# EAGLE design Power Supply Flat Rev C (EAGLE 9.6.2)
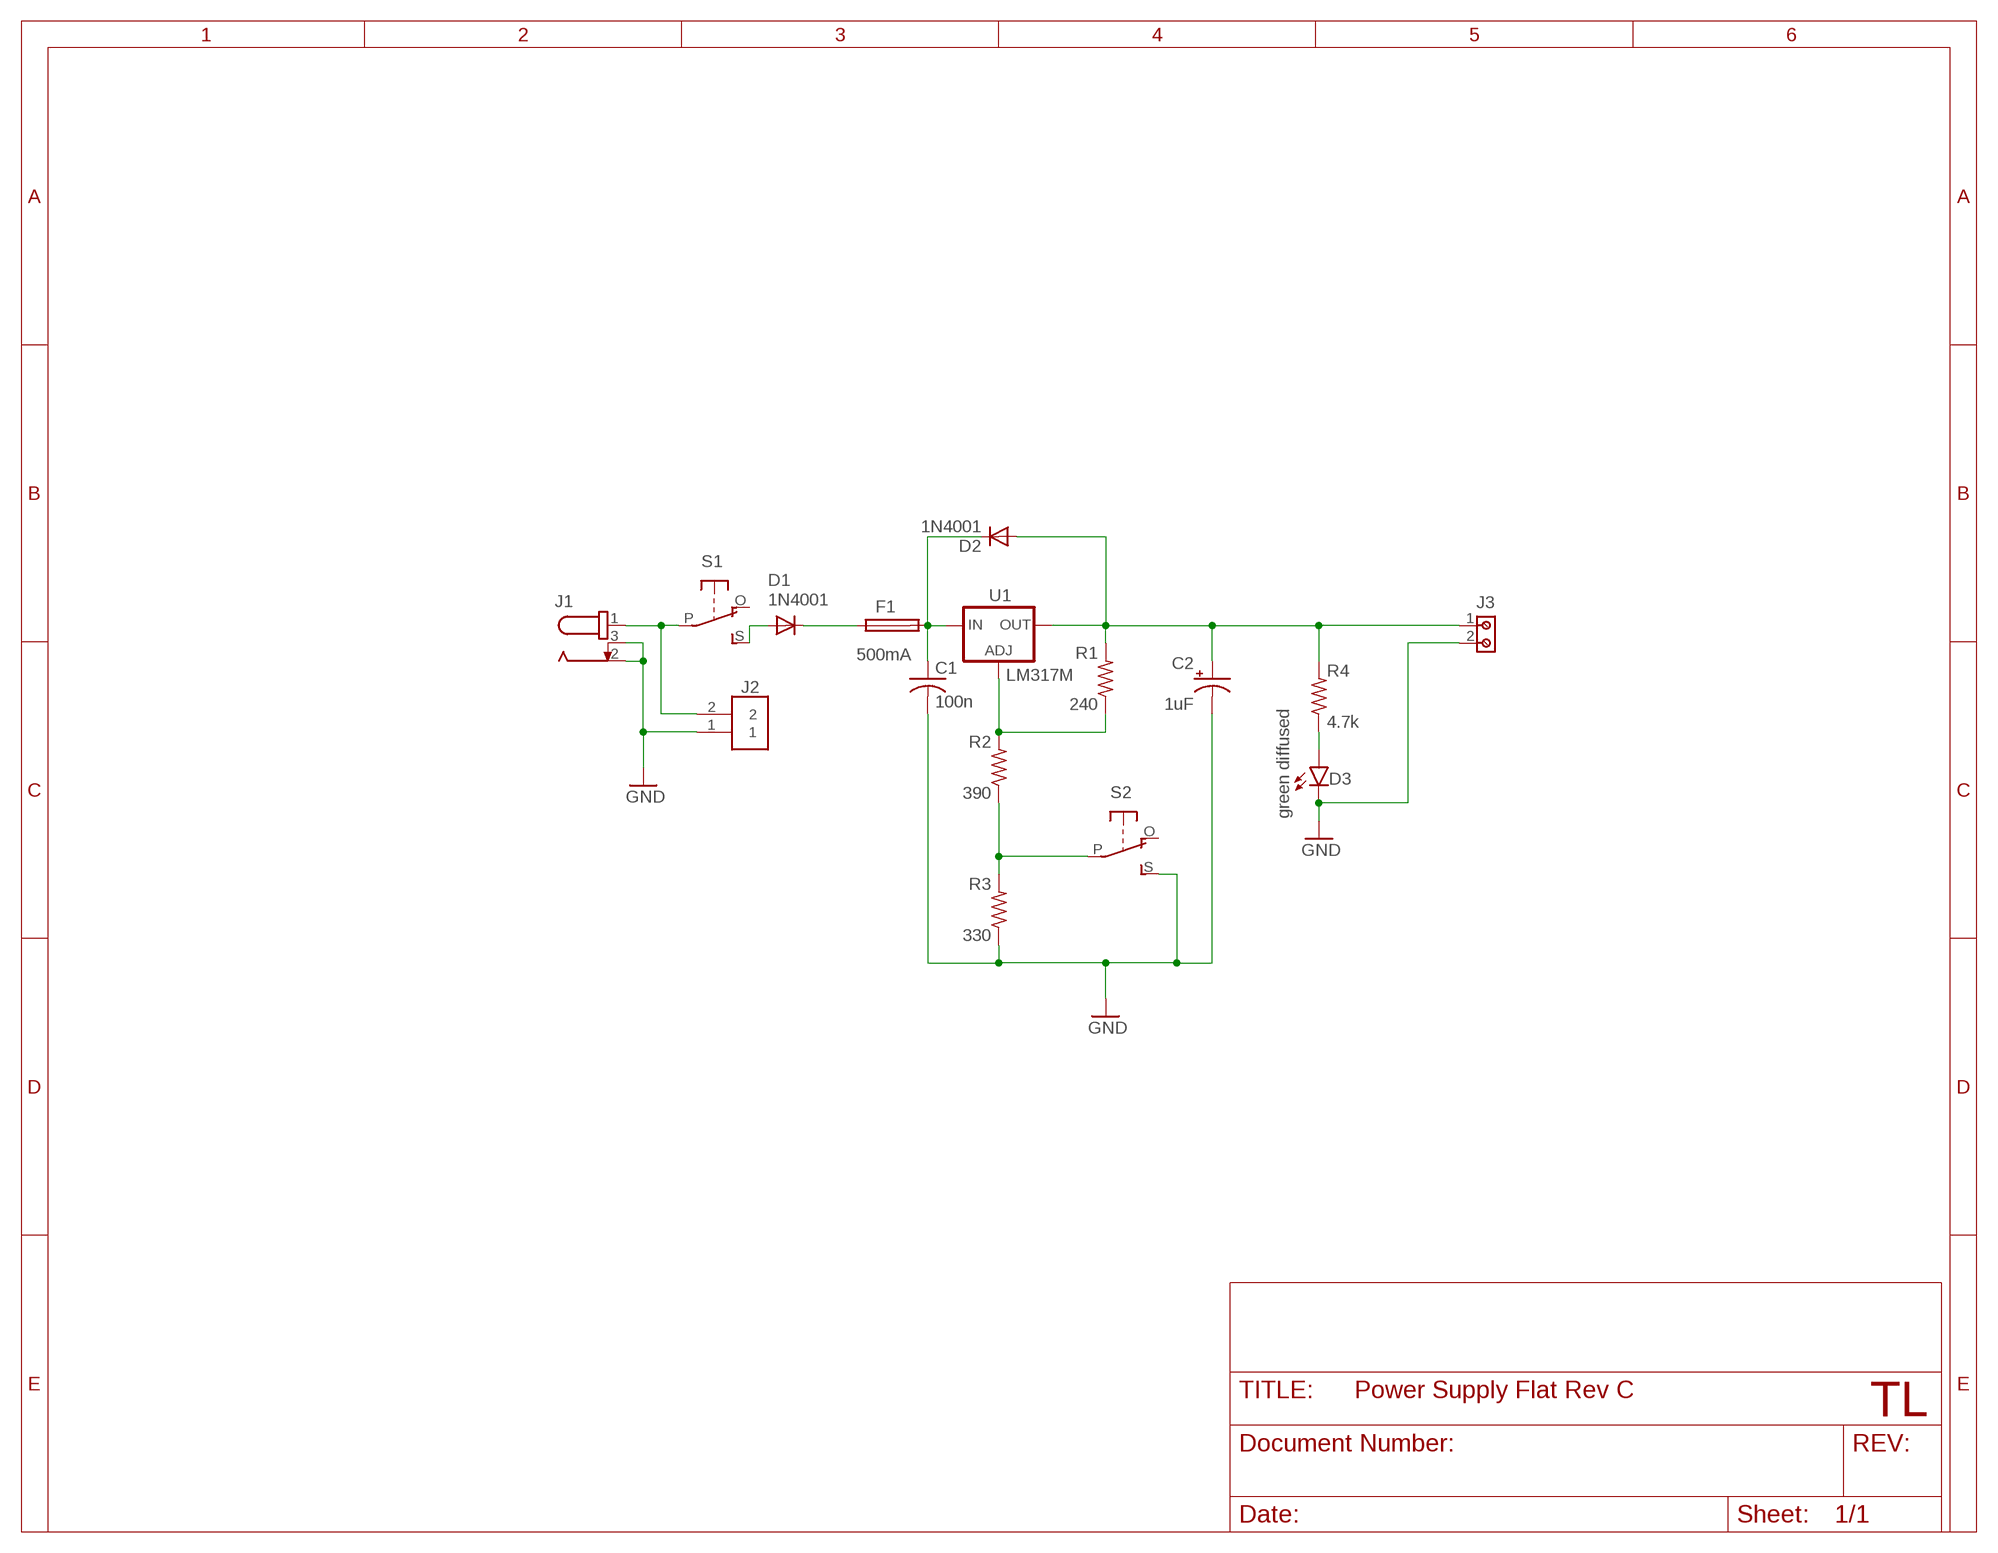
[diagram p0: schematic, sheet 1]

## Parts
C1  100n  CAPACITOR-CERAMIC  [C050-024X044]
C2  1uF  E-CAPACITOR2-4  [E2-4]
D1  1N4001  1N4000  [DO41-10]
D2  1N4001  1N4000  [DO41-10]
D3  green diffused  LED  [LED5MM]
F1  500mA  PTC-FUSE  [PTC-FUSE]
J1  694106301002  [694106301002]
J2  61300211121  [61300211121]
J3  691214110002  [691214110002]
R1  240  RESISTOR  [0207/10]
R2  390  RESISTOR  [0207/10]
R3  330  RESISTOR  [0207/10]
R4  4.7k  RESISTOR  [0207/10]
S1  SLIDE-SWITCHSIDE  [EG1270-90]
S2  SLIDE-SWITCHSIDE  [EG1270-90]
U1  LM317BENT  [T03B]

## Nets
GND: C1.2 C2.- D3.K(C) J1.2 J1.3 J2.1 J3.2 R3.1 S2.S
N$1: D1.A S1.S
N$2: J1.1 J2.2 S1.P
N$4: D1.C F1.1
N$5: C1.1 D2.C F1.2 U1.3(IN)
N$6: R1.1 R2.2 U1.1(ADJ)
N$7: C2.+ D2.A J3.1 R1.2 R4.2 U1.2(OUT)
N$8: R2.1 R3.2 S2.P
N$9: D3.A R4.1
Unconnected: S1.O S2.O

## Notes on the sheet
- TL

## Library data of the parts
C1 = Quantum Projects:CAPACITOR-CERAMIC
C2 = Quantum Projects:E-CAPACITOR
D1 D2 = Quantum Projects:1N4000
D3 = Quantum Projects:LED
F1 = Quantum Projects:PTC-FUSE
J1 = DC Power Jacks:694106301002: CONN PWR JACK 2.1X5.5MM SOLDER Manufacturer's datasheet <https://katalog.we-online.de/em/datasheet/6941xx301002.pdf>; CREATED_BY: PCBLayout.com; DIGIKEY_PART_NUMBER: 732-5930-ND; MANUFACTURER: Wurth Electronics Inc.; MPN: 694106301002
J2 = Headers:61300211121: CONN HEADER VERT 2POS 2.54MM Manufacturer's datasheet <https://katalog.we-online.de/em/datasheet/6130xx11121.pdf>; CREATED_BY: PCBLayout.com; DIGI_KEY_PART_NUMBER: 732-5315-ND; MANUFACTURER: Wurth Electronics Inc.; MPN: 61300211121
J3 = Wurth_Connectors_WR-TBL Rising Cage Clamp:691214110002: WR-TBL Serie 2141 - 3.50 mm Horiz. Entry Modular KIND PROPERTIES Pitch 3.5 mm MATERIAL PROPERTIES Insulator Material PA66 Insulator Flammability Rating UL94 V-0 Insulator Color Green Contact Material Brass Contact Plating Copper over Zinc Terminal Screw Material Steel Terminal Screw Plating Zinc Wire Guard Material Brass GENERAL INFORMATION Operating Temperature -40 up to +105 °C Compliance Lead free / RoHS ELECTRICAL PROPERTIES IR cULus 10 A Working Voltage [cULus] 300 V (AC) Withstanding Voltage [cULus] 1600 V (AC) Contact Resistance [cULus] 20 mΩ MECHANICAL PROPERTIES Wire Strip Length 5 up to 6 (mm) Screw M2 Solid Wire Section (AWG) 24 to 16 (AWG) Solid Wire Section (Metric) 0.205 to 1.31 (mm²) Stranded Wire Section (AWG) 24 to 16 (AWG) Stranded Wire Section (Metric) 0.205 to 1.31 (mm²) CERTIFICATION cULus Approval E315414 PACKAGING PROPERTIES Packaging Box <https://katalog.we-online.com/media/images/v2/o32858v209%20Family_WR-TBL2_Series2141S.jpg> Details see: https://katalog.we-online.com/en/em/TBL_3_50_2141_HORIZONTAL_ENTRY_MODULAR_69121411000X Updated by Ella Wu 2019-11-12 2019(C) Wurth Elektronik; DATASHEET-URL: https://www.we-online.com/catalog/datasheet/691214110002.pdf; IR-UL: 10A; MOUNT: THT; PART-NUMBER: 691214110002; PINS: 2; PITCH: 3.5mm; TYPE: Horizontal; WIRE: 24 to 16 (AWG) 0.205 to 1.31 (mm²); WORKING-VOLTAGE-UL: 300V (AC)
R1-R4 = Quantum Projects:RESISTOR
S1 S2 = Quantum Projects:SLIDE-SWITCH
U1 = Quantum Projects:LM317; PARTNUMBER: LM317M

## Board
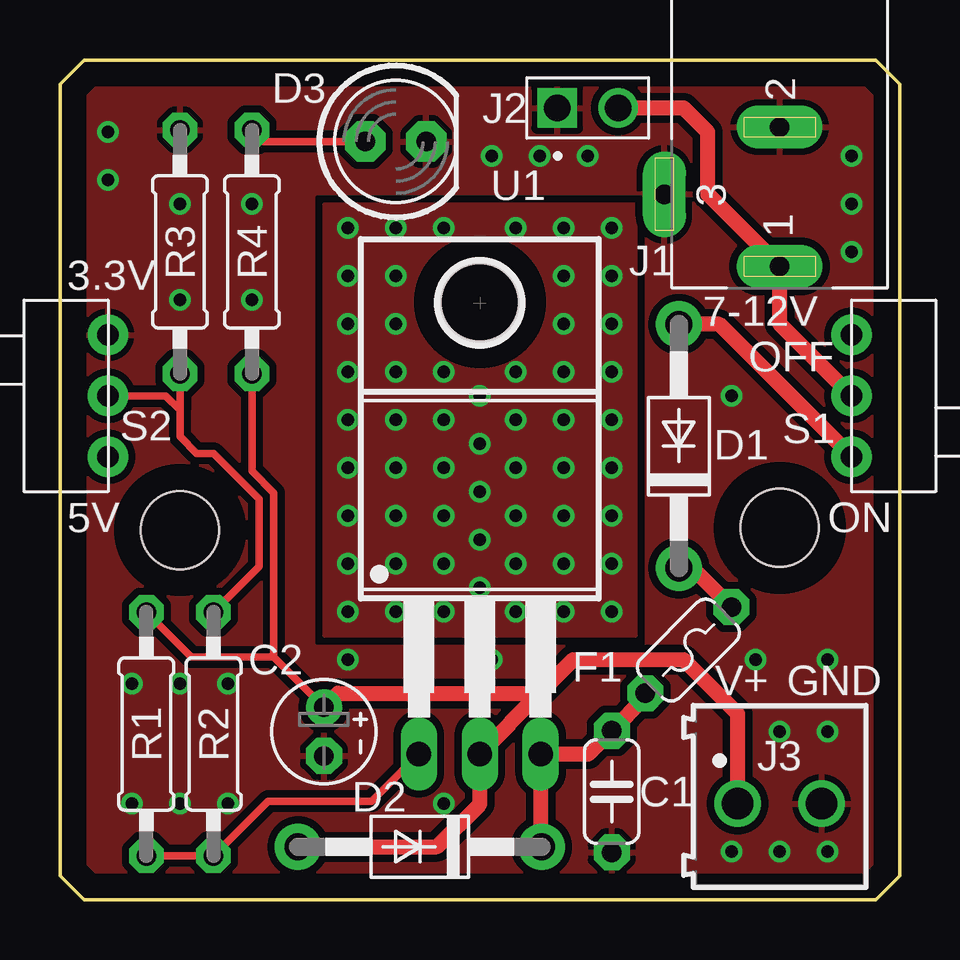
[diagram p1: board, top side]
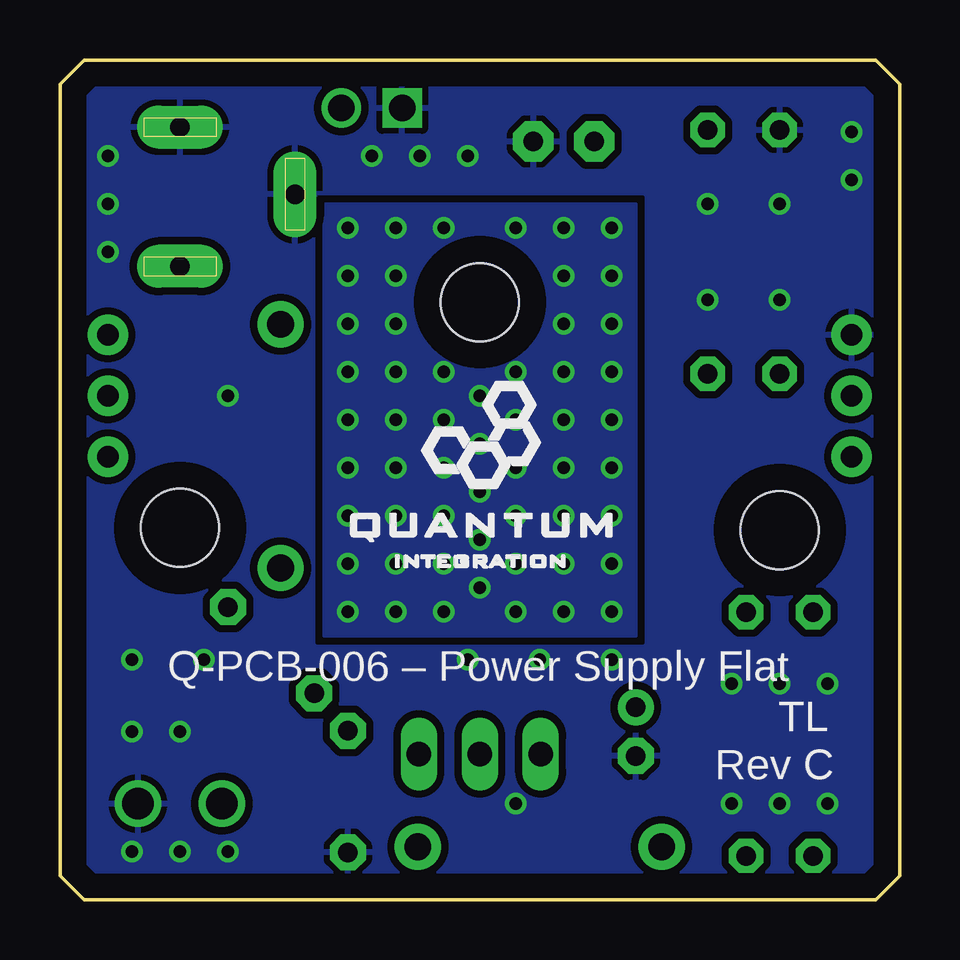
[diagram p2: board, bottom side, seen from below]

Size 35 x 35 mm. Coordinates in mm from the lower left corner, seen from the top.
Outline: 0,1 0,34 1,35 34,35 35,34 35,1 34,0 1,0 0,1
Copper layers (1*16): Top 0.035mm / dielectric 1.5mm / Bottom 0.035mm
Design rules "quantum-drc": minimum track width 12mil, minimum drill 0.35mm, track to track 12mil, track to pad 8mil, pad to pad 12mil, via to via 10mil, smd to smd 6mil, copper to edge 40mil, drill to drill 6mil, minimum pad ring 10mil, minimum via ring 8mil, stop-mask expansion 4mil, vias tented up to drill 50mil, thermal gap 10mil
Holes 3.25 mm at 30,15.5 5,15.4 17.5,24.9
tRestrict: area 27.2,12.8 to 32.8,18.2; area 2.2,12.7 to 7.8,18.1; area 14.8,22.1 to 20.2,27.6
bRestrict: area 2.2,12.7 to 7.8,18.1; area 27.2,12.8 to 32.8,18.2; area 14.8,22.1 to 20.2,27.6

### Footprints (pad centres in the part's own frame; a part is rotated, then mirrored left to right if it is on the bottom)
C050-024X044 = drill 0.813 pad 1.5 octagon: 1 -2.54,0; 2 2.54,0
E2-4 = drill 0.813 pad 1.5: + -1.016,0 | drill 0.813 pad 1.5 octagon: - 1.016,0
DO41-10 = drill 1.118 pad 1.93: A 5.08,0; C -5.08,0
LED5MM = drill 0.813 pad 1.676 octagon: A -1.27,0; K 1.27,0
PTC-FUSE = drill 0.813 pad 1.5 octagon: 1 -2.54,0; 2 2.54,0
694106301002 = drill 0.8 pad 1.8 long: 1 13.6,0; 2 7.8,0; 3 10.6,-4.8
61300211121 = drill 1.1 square: 1 -1.27,0 | drill 1.1: 2 1.27,0
691214110002 = drill 1.3: 1 -1.75,0; 2 1.75,0
0207/10 = drill 0.813 pad 1.43 octagon: 1 -5.08,0; 2 5.08,0
EG1270-90 = drill 0.9 pad 1.676: O -2.54,0; P 0,0; S 2.54,0
T03B = drill 1.016 long: 1 -2.54,-11.43; 2 0,-11.43; 3 2.54,-11.43

### Placement (x,y rotation side)
C1  23,4.5 270 top
C2  11,7 270 top
D1  25.8,18.9 90 top
D2  15,2.2 180 top
D3  14,31.6 0 top
F1  26.2,10.4 225 top
J1  30,40 270 top
J2  22,33 0 top
J3  30,4 0 top
R1  3.6,6.9 90 top
R2  6.4,6.9 270 top
R3  5,27 270 top
R4  8,27 270 top
S1  33,21 270 top
S2  2,21 90 top
U1  17.5,17.5 0 top

### Tracks (layer width: path | path; a pad name or v marks a point on that pad's centre or on a via)
GND  (via drill 0.51)
  other vias: 5,25 5,29 8,29 8,25 28,21 32,7 30,7 28,2 30,2 32,2 7,9 5,9 3,9 3,4 5,4 7,4 2,32 2,30 18,31 20,31 22,31 33,31 33,29 33,27 29,10 32,10 18,10 15,10 12,10 16,4
  pour Bottom (rank 2): 1,0 0,1 0,34 1,35 34,35 35,34 35,1 34,0
  pour Top (rank 2): 0,34 1,35 34,35 35,34 35,1 34,0 1,0 0,1
N$1
  Top 0.635: S1.S 27.48,23.98 D1.A
N$2
  Top 0.635: J2.2 26,33 27,32 27,29.4 J1.1 30,24 S1.P
N$4
  Top 0.635: D1.C 26.37,13.82 F1.1
N$5
  Top 0.635: U1.3 20.04,5.04 | U1.3 20.04,2.24 D2.C | U1.3 22.03,6.07 C1.1 24.4,8.44 F1.2
N$6
  Top 0.305: U1.1 12.99,4.1 8.68,4.1 R2.2 R1.1
N$7
  Top 0.305: R4.2 8,17.86 8.91,16.95 8.91,10.11 | 8.91,10.11 C2.+ | R1.2 5.47,10.11 8.91,10.11
  Top 0.635: 19.99,8.6 18.76,7.36 18.76,7.33 U1.2 17.5,3.97 15.73,2.2 D2.A | C2.+ 11.58,8.6 19.99,8.6 | J3.1 28.25,7.75 26,10 21.39,10 19.99,8.6
N$8
  Top 0.305: R3.2 5,20.4 | 5,20.4 5,19.3 5.7,18.6 6.4,18.6 8.3,16.7 8.3,13.88 R2.1 | S2.P 4.4,21 5,20.4
N$9
  Top 0.305: D3.A 8.48,31.6 R4.1
TO_HS  (via drill 0.51)
  other vias: 21,26 21,24 21,22 19,22 16,22 14,22 14,24 14,26 14,20 14,18 14,16 14,14 16,14 16,16 16,18 16,20 19,20 19,18 19,16 19,14 21,14 21,16 21,18 21,20 12,14 12,16 12,18 12,20 12,22 12,24 12,26 12,28 14,28 16,28 19,28 21,28 17.5,21 17.5,19 17.5,17 17.5,15 17.5,13 16,12 14,12 12,12 19,12 21,12 23,12 23,14 23,16 23,18 23,20 23,22 23,24 23,26 23,28
  pour Top: 11,29 24,29 24,11 11,11
  pour Bottom: 11,11 11,29 24,29 24,11

### Text on the board
tNames: 3.3V | 7-12V | OFF | 5V | ON | V+ | GND
bNames: Q-PCB-006 – Power Supply Flat | TL | Rev C